# EAGLE design wsb2812-adapter (EAGLE 7.3.0)
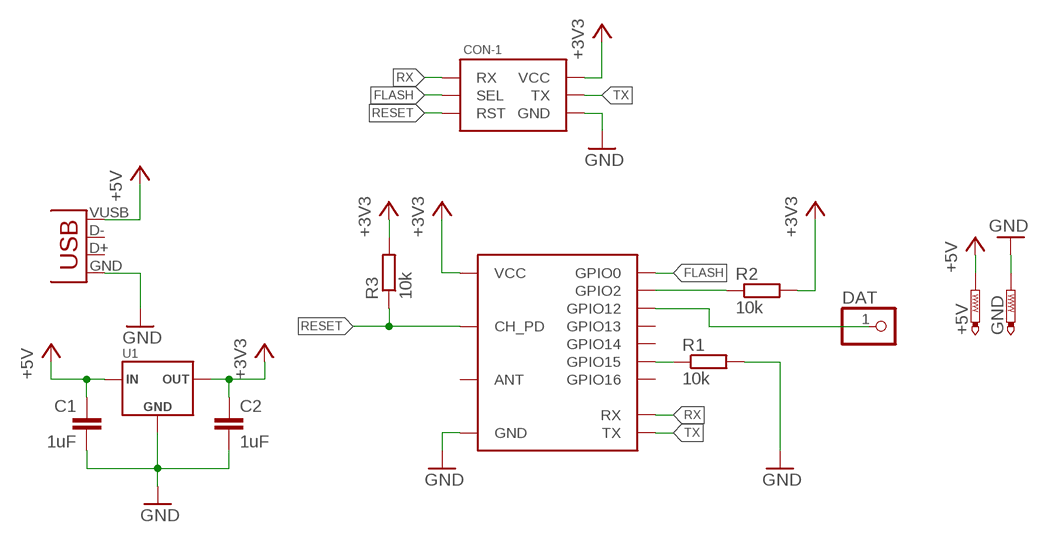
[diagram p0: schematic, sheet 1]

## Parts
+5V  PTR1PAD1-20  [P1-20]
C1  1uF  C-EUC0805  [C0805]
C2  1uF  C-EUC0805  [C0805]
CON1  USBMICRO-NO_CENTER  [USB-MICRO-SMD-NO_CENTER]
CON-1  ESP8266-6_PIN-POGO  [POGO-1.27-6_PIN-MADWORM]
DAT  PINHD-1X1  [1X01]
GND  PTR1PAD1-20  [P1-20]
R1  10k  R-EU_R0603  [R0603]
R2  10k  R-EU_R0603  [R0603]
R3  10k  R-EU_R0603  [R0603]
U1  REGULATOR-XC6206SOT23  [SOT23]
U$1  ESP8266-03  [ESP8266-ESP-03]

## Nets
+3V3: C2.1 CON-1.P$2(VCC) R2.2 R3.2 U1.P$2(OUT) U$1.P$8(VCC)
+5V: +5V.TP C1.1 CON1.VUSB(VBUS) U1.P$3(IN)
FLASH: CON-1.P$3(SEL) U$1.P$14(GPIO0)
GND: C1.2 C2.2 CON1.GND CON-1.P$6(GND) GND.TP R1.2 U1.P$1(GND) U$1.P$1(GND)
N$1: R1.1 U$1.P$12(GPIO15)
N$2: DAT.1 U$1.P$10(GPIO12)
N$3: R2.1 U$1.P$13(GPIO2)
RESET: CON-1.P$5(RST) R3.1 U$1.P$6(CH_PD)
RX: CON-1.P$1(RX) U$1.P$4(RX)
TX: CON-1.P$4(TX) U$1.P$3(TX)
Unconnected: CON1.D+ CON1.D- U$1.P$5(GPIO16) U$1.P$7(ANT) U$1.P$9(GPIO14) U$1.P$11(GPIO13)

## Library data of the parts
+5V GND = testpad:PTR1: TEST PIN
C1 C2 = p.peter-rcl:C-EU: CAPACITOR, European symbol
CON1 = p.peter-connectors:USB
CON-1 = p.peter-connectors:ESP8266-6_PIN
DAT = pinhead:PINHD-1X1: PIN HEADER
R1-R3 = p.peter-rcl:R-EU_: RESISTOR, European symbol
U1 = p.peter-regulators:REGULATOR-XC6206
U$1 = p.peter-periphery:ESP8266-03

## Board
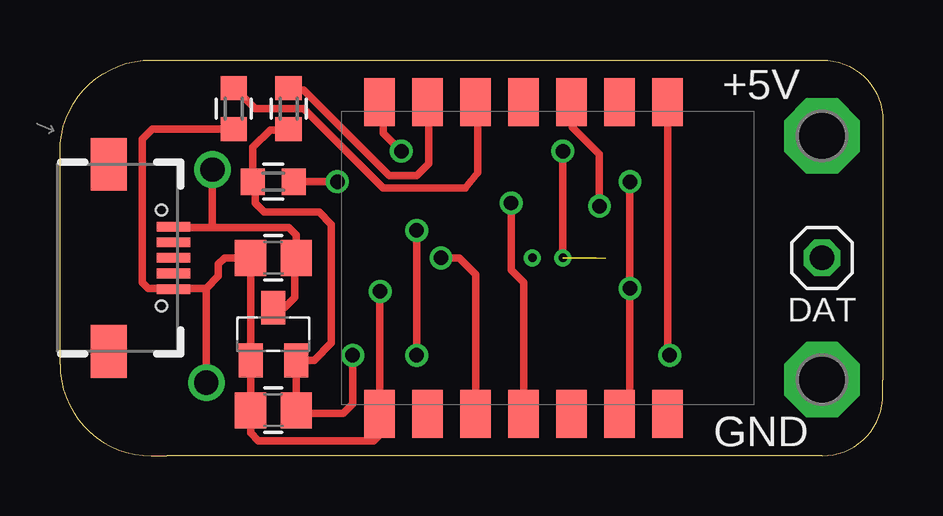
[diagram p1: board, top side]
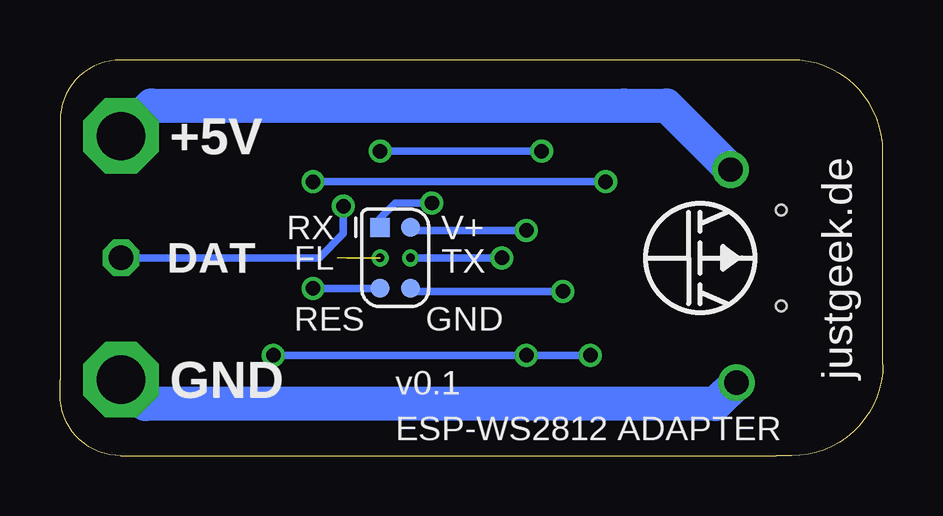
[diagram p2: board, bottom side, seen from below]

Size 34.29 x 16.51 mm. Coordinates in mm from the lower left corner, seen from the top.
Outline: 0,3.81 0,8.26 0,12.7 arc-90 3.81,16.51 5.08,16.51 31.75,16.51 arc-90 34.29,13.97 34.29,13.34 34.29,8.26 34.29,3.17 34.29,2.54 arc-90 31.75,0 4.45,0 3.81,0 arc-90 0,3.81
Copper layers (1*16): Top 0.0356mm / dielectric 1.5011mm / Bottom 0.0356mm
Design rules "oshpark": minimum track width 6mil, minimum drill 13mil, track to track 6mil, track to pad 6mil, pad to pad 6mil, via to via 6mil, smd to smd 6mil, copper to edge 15mil, drill to drill 6mil, minimum pad ring 7mil, minimum via ring 7mil, stop-mask expansion 4mil, vias tented up to drill 4.1mm, thermal gap 10mil

### Footprints (pad centres in the part's own frame; a part is rotated, then mirrored left to right if it is on the bottom)
P1-20 = drill 2.007 pad 3.15 octagon: TP 0,0
C0805 = smd 1.3 x 1.5: 1 -0.95,0; 2 0.95,0
USB-MICRO-SMD-NO_CENTER = smd 1.4 x 0.4: D+ 1.43,0; D- 1.43,0.65; GND 1.43,-1.3; ID 1.43,-0.65; VUSB 1.43,1.3 | smd 1.5 x 2.2: P$1 -1.27,3.9; P$2 -1.27,-3.9 | hole 0.45: 0.93,2; 0.93,-2
POGO-1.27-6_PIN-MADWORM = smd 0.8 x 0.8: P$1 -1.27,-0.635; P$2 -1.27,0.635; P$5 1.27,-0.635; P$6 1.27,0.635 | drill 0.35: P$3 0,-0.635; P$4 0,0.635
1X01 = drill 1.016 octagon: 1 0,0
R0603 = smd 1 x 1.1: 1 -0.85,0; 2 0.85,0
SOT23 = smd 1 x 1.4: P$1 -0.95,-1.1; P$2 0.95,-1.1; P$3 0,1.1
ESP8266-ESP-03 = smd 1.27 x 2: P$1 7,6.5; P$2 5,6.5; P$3 3,6.5; P$4 1,6.5; P$5 -1,6.5; P$6 -3,6.5; P$7 -5,6.5; P$8 -5,-6.5; P$9 -3,-6.5; P$10 -1,-6.5; P$11 1,-6.5; P$12 3,-6.5; P$13 5,-6.5; P$14 7,-6.5

### Placement (x,y rotation side)
+5V  31.75,13.34 0 top
C1  8.89,8.26 180 top
C2  8.89,1.91 180 top
CON1  3.3,8.26 0 top
CON-1  20.32,8.26 270 bottom
DAT  31.75,8.26 0 top
GND  31.75,3.17 0 top
R1  7.24,14.48 270 top
R2  9.53,14.48 270 top
R3  8.89,11.43 180 top
U1  8.89,5.08 0 top
U$1  20.32,8.26 180 top
U$3  [LOGO-JUSTGEEK-XS]  7.62,8.26 90 bottom

### Tracks (layer width: path | path; a pad name or v marks a point on that pad's centre or on a via)
+3V3  (via drill 0.6)
  Top 0.305: R2.2 9.49,13.59 8.76,13.59 8.04,12.87 R3.2 8.13,11.64 8.13,10.54 8.51,10.16 10.79,10.16 11.3,9.65 11.3,4.7 10.58,3.98 U1.P$2 C2.1 9.97,1.78 11.81,1.78 12.19,2.16 v12.19,4.19 | U$1.P$8 25.32,4.27 v25.4,4.19 | v14.86,9.4 v14.86,4.19
  Bottom 0.305: v25.4,4.19 v14.86,4.19 v12.19,4.19 | CON-1.P$2 19.81,9.4 v14.86,9.4
+5V  (via drill 1.02)
  Top 0.305: U1.P$3 9.36,6.18 9.78,6.6 9.78,8.19 C1.1 9.84,9.21 9.53,9.53 6.35,9.53 | 6.35,9.53 5.27,9.53 CON1.VUSB | v6.35,11.94 6.35,9.53
  Bottom 1.422: +5V.TP 30.48,14.61 10.79,14.61 9.02,14.61 v6.35,11.94
FLASH  (via drill 0.6)  (3 unrouted)
  Top 0.305: CON-1.P$3 v20.95,12.7 | v14.22,12.7 13.46,13.46 13.46,15.11 12.96,15.11 U$1.P$14
  Bottom 0.305: v20.95,12.7 v14.22,12.7
GND  (via drill 0.6, 1.02)
  Top 0.305: R1.2 3.85,13.63 3.43,13.21 3.43,7.24 3.68,6.99 5.21,6.99 CON1.GND 4.76,6.99 6.1,6.99 | v13.34,6.86 13.32,6.84 U$1.P$1 13.34,1.74 13.34,0.89 13.08,0.64 8.26,0.64 7.94,0.95 C2.2 U1.P$1 C1.2 6.86,8.26 6.6,8 6.6,7.49 6.1,6.99 | v6.1,3.05 6.1,3.56 6.1,6.99
  Bottom 0.305: v13.34,6.86 19.56,6.86 CON-1.P$6
  Bottom 1.422: v6.1,3.05 6.99,2.16 30.73,2.16 GND.TP
N$1
  Top 0.305: R1.1 7.28,15.33 8.13,14.48 10.16,14.48 13.46,11.18 14.22,11.18 16,11.18 16.89,11.18 17.4,11.81 17.4,14.68 U$1.P$12
N$2  (via drill 0.6)
  Top 0.305: v22.48,10.41 22.48,12.57 21.34,13.72 21.34,14.74 U$1.P$10
  Bottom 0.305: DAT.1 24,8.26 23.5,8.26 22.48,9.27 v22.48,10.41
N$3
  Top 0.305: R2.1 9.61,15.24 10.16,15.24 13.72,11.68 14.86,11.68 15.37,12.19 15.37,14.73 15.34,14.73 U$1.P$13
RESET  (via drill 0.6)
  Top 0.305: U$1.P$6 23.67,2.11 23.7,2.11 23.75,2.16 v23.75,6.99 23.75,7.24 v23.75,11.43 | R3.1 9.91,11.68 10.16,11.43 v11.56,11.43
  Bottom 0.305: v23.75,6.99 CON-1.P$5 | v11.56,11.43 15.11,11.43 15.24,11.43 v23.75,11.43
RX  (via drill 0.6)
  Top 0.305: U$1.P$4 19.32,7.22 18.8,7.75 v18.8,10.54
  Bottom 0.305: v18.8,10.54 20.32,10.54 20.95,9.91 CON-1.P$1
TX  (via drill 0.6)
  Top 0.305: U$1.P$3 17.32,7.57 16.64,8.26 v15.88,8.26
  Bottom 0.305: CON-1.P$4 19.56,8.26 v15.88,8.26

### Text on the board
bPlace: +5V | V+ | RX | TX | FL | DAT | GND | RES | justgeek.de | v0.1 | GND | ESP-WS2812 ADAPTER